# EAGLE design PiZeroAudioI2SPam8403 (EAGLE 9.1.3)
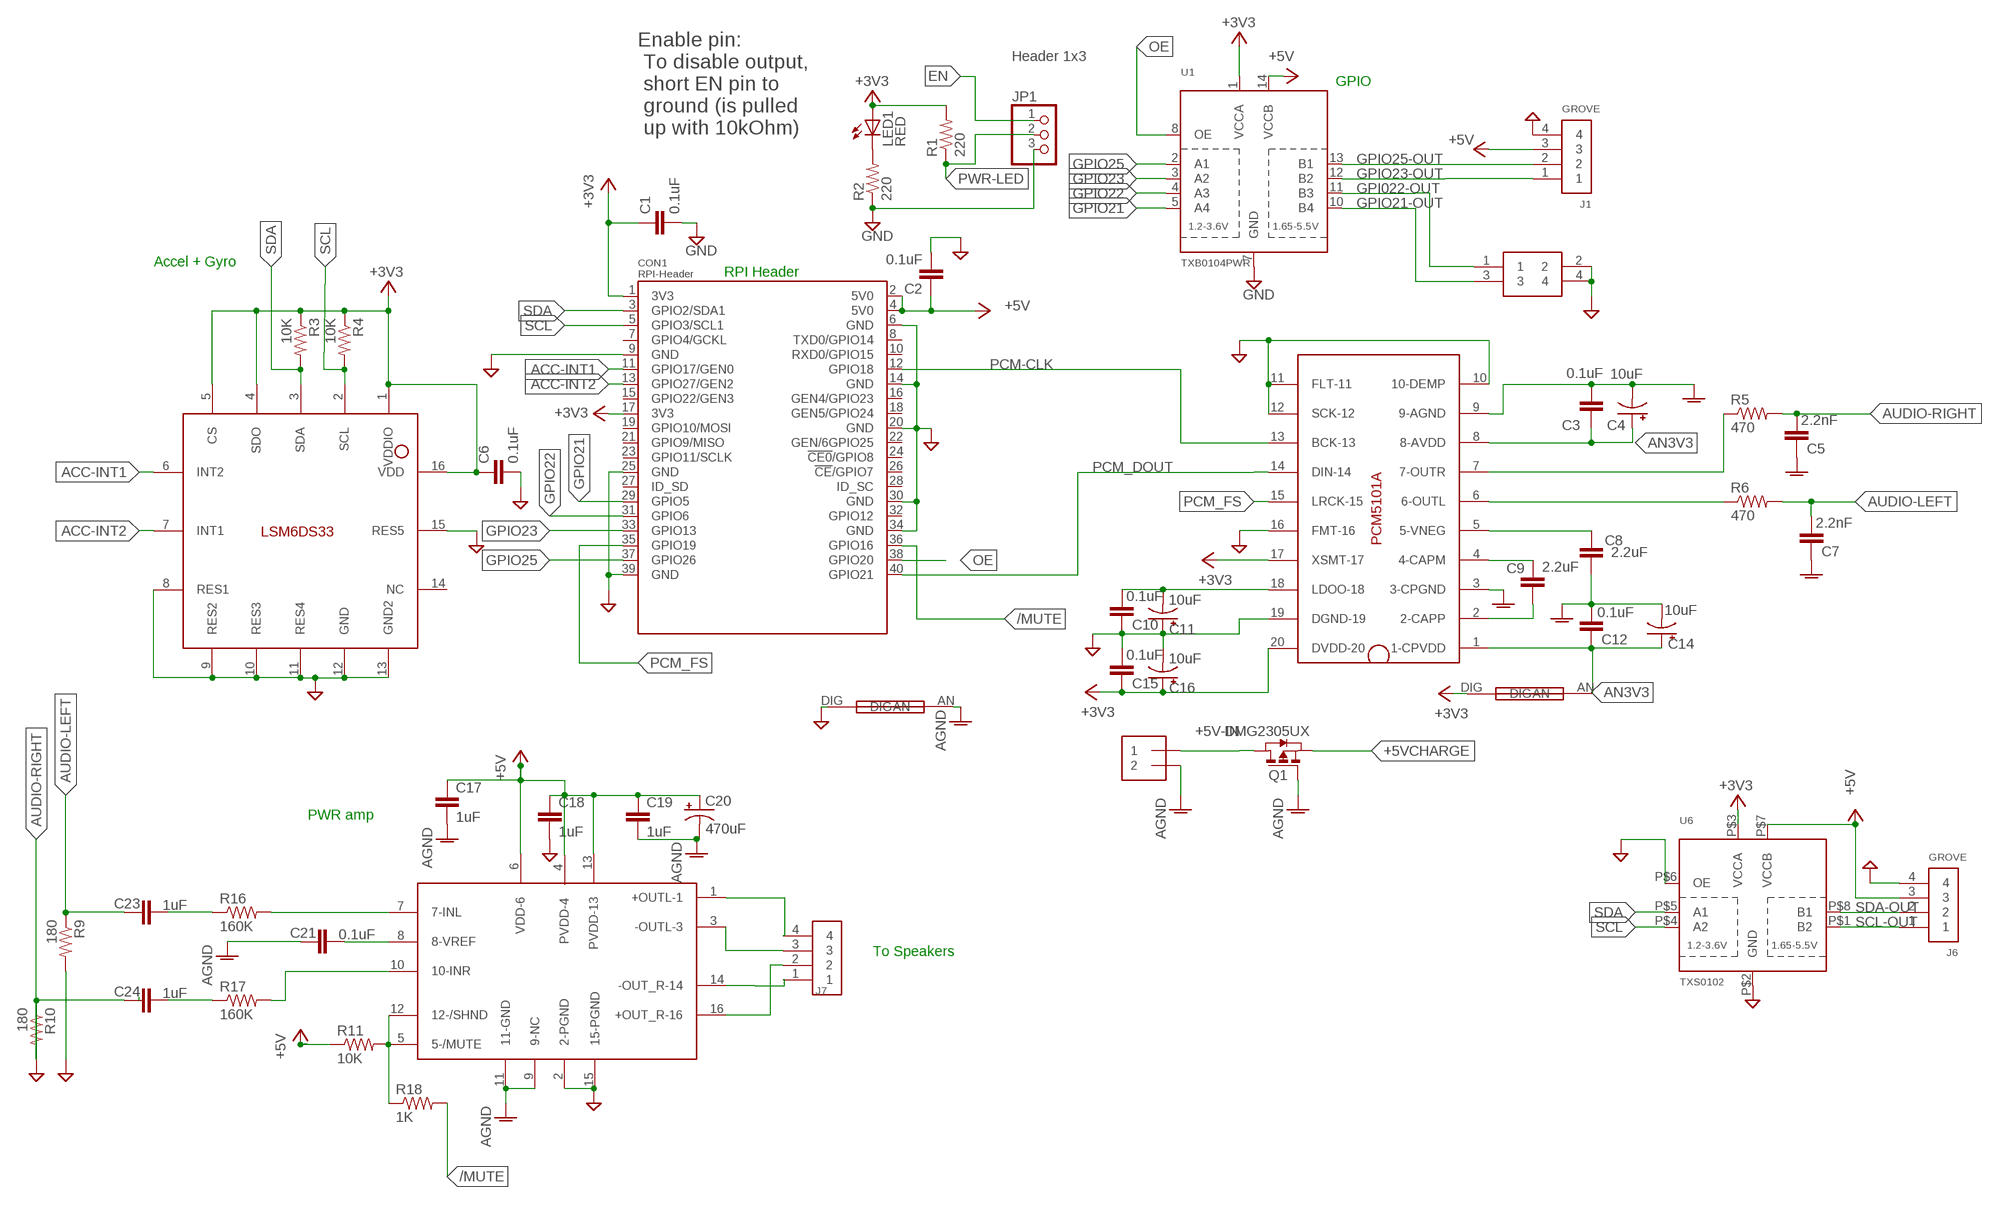
[diagram p0: schematic, sheet 1, part 1 of 2]
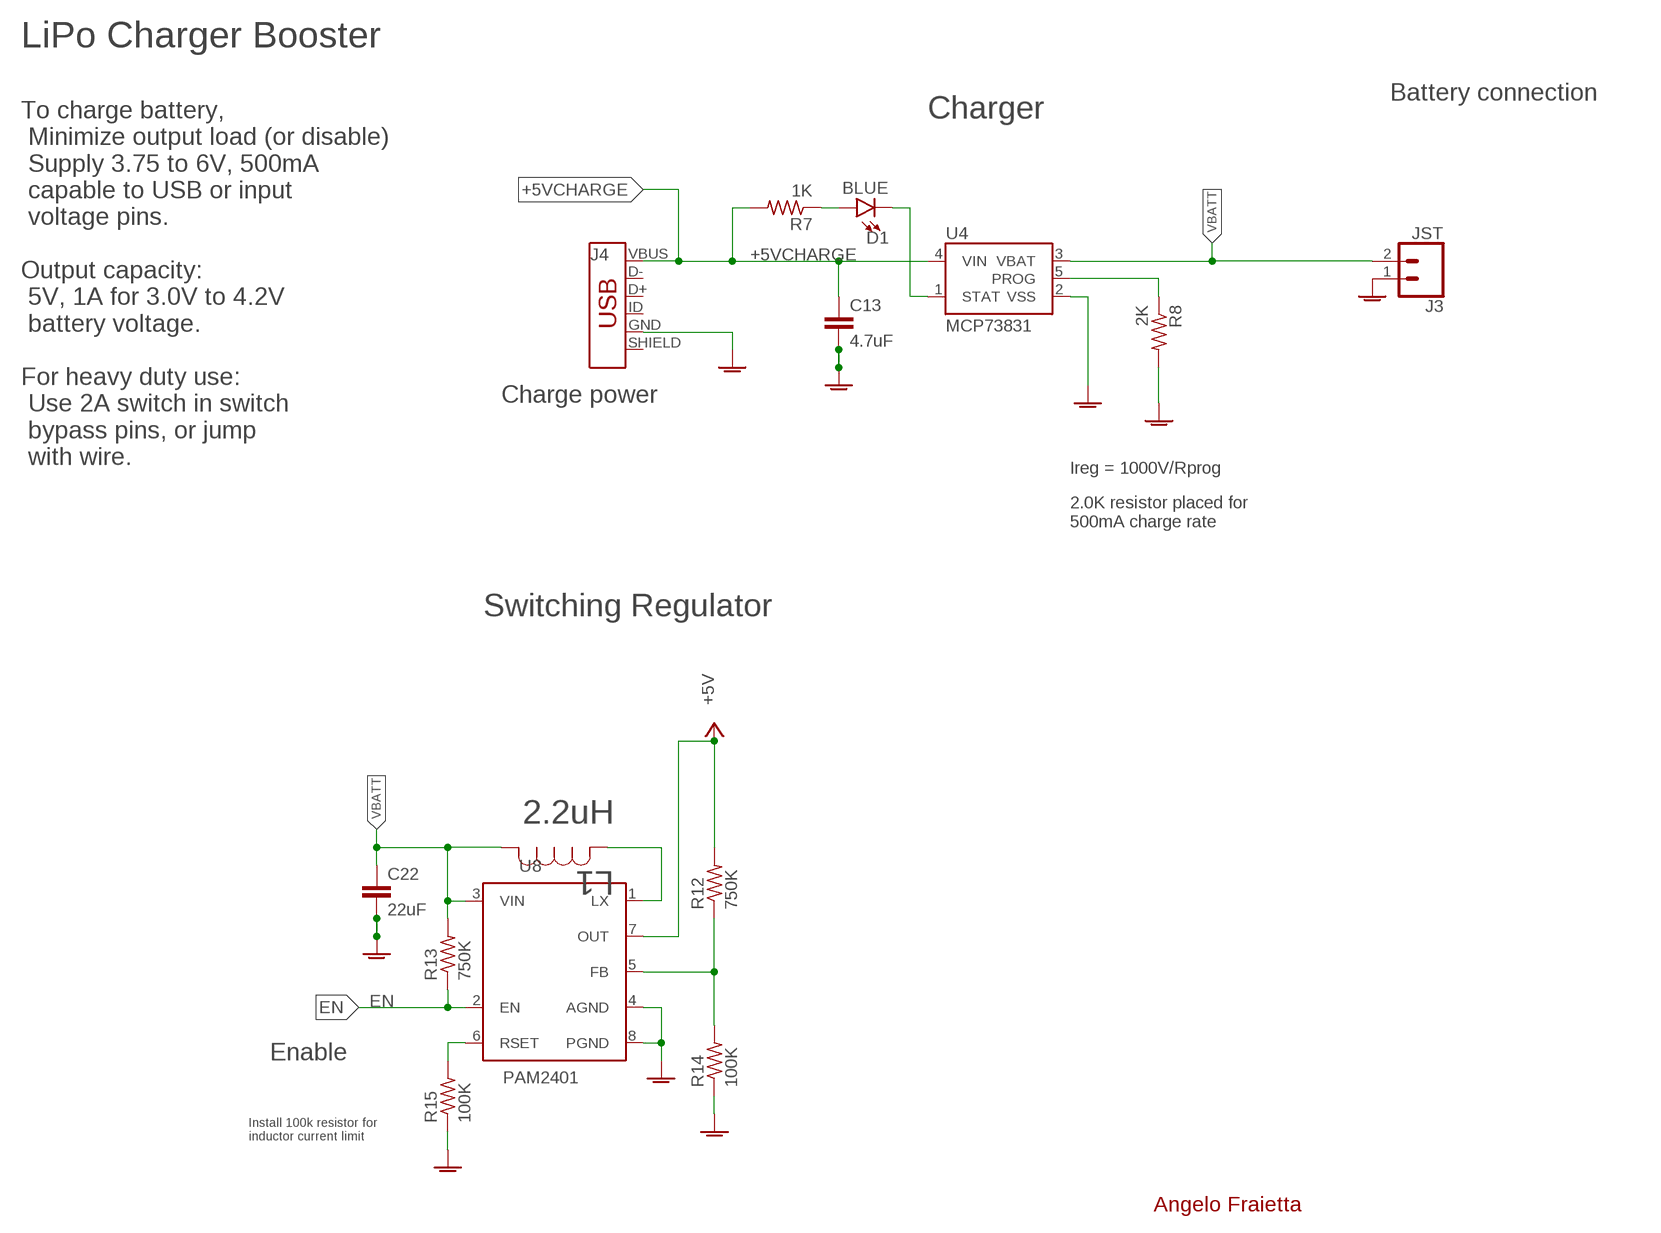
[diagram p1: schematic, sheet 1, part 2 of 2]

## Parts
C1  0.1uF  C-EUC0603  [C0603]
C2  0.1uF  C-EUC0603  [C0603]
C3  0.1uF  C-EUC0603  [C0603]
C4  10uF  CAP-POLARISED1206-POLAR  [EIA3216]
C5  2.2nF  C-EUC0603  [C0603]
C6  0.1uF  C-EUC0603  [C0603]
C7  2.2nF  C-EUC0603  [C0603]
C8  2.2uF  C-EUC0603  [C0603]
C9  2.2uF  C-EUC0603  [C0603]
C10  0.1uF  C-EUC0603  [C0603]
C11  10uF  CAP-POLARISED1206-POLAR  [EIA3216]
C12  0.1uF  C-EUC0603  [C0603]
C13  4.7uF  C-EUC0603  [C0603]
C14  10uF  CAP-POLARISED1206-POLAR  [EIA3216]
C15  0.1uF  C-EUC0603  [C0603]
C16  10uF  CAP-POLARISED1206-POLAR  [EIA3216]
C17  1uF  C-EUC0603  [C0603]
C18  1uF  C-EUC0603  [C0603]
C19  1uF  C-EUC0603  [C0603]
C20  470uF  CAP-POLARISED2917-POLAR  [EIA7343]
C21  0.1uF  C-EUC0603  [C0603]
C22  22uF  C-EUC0603  [C0603]
C23  1uF  C-EUC0603  [C0603]
C24  1uF  C-EUC0603  [C0603]
CON1  RPI-Header  RPI-ZERO  [RASPBERRYPI_BASTELSTUBE_V13_RASPI_BOARD_B+_FULL]
D1  BLUE  LED-BLUE0603  [LED-0603]
J1  GROVE  [JST-PH4]
J2  2X2HEADER  [2X2]
J3  JST  CONN_02-JST-2MM-SMT  [JST-2-SMD]
J4  AMP FCI 10103594-0001LF  AMP10103594-0001LF  [USB-MICROB-PTH]
J5  2X1-LOCKING  [22-23-2021]
J6  GROVE  [JST-PH4]
J7  4X1-LOCKING  [22-23-2041]
JP1  Header 1x3  PINHD-1X3  [1X03]
L1  2.2uH  IFSC1515AHER2R2M01  [IND_IFSC_1515AH]
LED1  RED  LEDCHIP-LED0805  [CHIP-LED0805]
Q1  DMG2305UX  [SOT23]
R1  220  R-US_R0603  [R0603]
R2  220  R-US_R0603  [R0603]
R3  10K  R-US_R0603  [R0603]
R4  10K  R-US_R0603  [R0603]
R5  470  R-US_R0603  [R0603]
R6  470  R-US_R0603  [R0603]
R7  1K  R-US_R0603  [R0603]
R8  2K  R-US_R0603  [R0603]
R9  180  R-US_R0603  [R0603]
R10  180  R-US_R0603  [R0603]
R11  10K  R-US_R0603  [R0603]
R12  750K  R-US_R0603  [R0603]
R13  750K  R-US_R0603  [R0603]
R14  100K  R-US_R0603  [R0603]
R15  100K  R-US_R0603  [R0603]
R16  160K  R-US_R0603  [R0603]
R17  160K  R-US_R0603  [R0603]
R18  1K  R-US_R0603  [R0603]
SH1  SHORT  [SHORT]
SH2  SHORT  [SHORT]
U1  TXB0104PWR  [TSSOP14]
U2  LSM6DS33  LSM6DS33LGA-16-3X3  [LGA-16-3X3]
U3  PCM5101A  [TSSOP20-0.65-6.5X4.4MM]
U4  MCP73831  [SOT23-5]
U6  TXS0102  [VFSOP-8]
U7  PAM8403  [SOP-16]
U8  PAM2401  [MSOP8]

## Nets
+3V3: C1.1 C6.1 C15.2 C16.+ CON1.1(3V3) CON1.17(3V3) LED1.A R1.2 R3.1 R4.1 SH1.DIG U1.1(VCCA) U2.1(VDDIO) U2.4(SDO) U2.5(CS) U2.16(VDD) U3.17(XSMT-17) U3.20(DVDD-20) U6.P$3(VCCA)
+5V: C2.1 C17.1 C18.1 C19.1 C20.+ CON1.2(5V0) CON1.4(5V0) J1.3 J6.3 R11.1 R12.2 U1.14(VCCB) U6.P$7(VCCB) U7.4(PVDD-4) U7.6(VDD-6) U7.13(PVDD-13) U8.7(OUT)
+5V-IN: J5.1 Q1.D
+5VCHARGE: C13.1 J4.VBUS Q1.S R7.2 U4.4(VIN)
/MUTE: CON1.36(GPIO16) R11.2 R18.1 R18.2 U7.5(5-/MUTE) U7.12(12-/SHND)
ACC-INT1: CON1.11(GPIO17/GEN0) U2.6(INT2)
ACC-INT2: CON1.13(GPIO27/GEN2) U2.7(INT1)
AGND: C3.1 C4.- C5.2 C7.2 C8.2 C12.1 C13.2 C14.- C17.2 C19.2 C20.- C21.2 C22.2 J3.1 J4.GND J5.2 Q1.G R8.2 R14.1 R15.1 SH2.AN U3.3(3-CPGND) U3.9(9-AGND) U4.2(VSS) U7.9(9-NC) U7.11(11-GND) U8.4(AGND) U8.8(PGND)
AN3V3: C3.2 C4.+ C12.2 C14.+ SH1.AN U3.1(1-CPVDD) U3.8(8-AVDD)
AUDIO-LEFT: C7.1 C23.2 R6.2 R9.1
AUDIO-RIGHT: C5.1 R5.2 R10.1
EN: JP1.1 R13.1 U8.2(EN)
GND: C1.2 C2.2 C6.2 C10.2 C11.+ C15.1 C16.- C18.2 C24.2 CON1.6(GND) CON1.9(GND) CON1.14(GND) CON1.20(GND) CON1.25(GND) CON1.30(GND) CON1.34(GND) CON1.39(GND) J1.4 J2.2 J2.4 J6.4 JP1.3 R2.1 R9.2 R10.2 SH2.DIG U1.7(GND) U2.8(RES1) U2.9(RES2) U2.10(RES3) U2.11(RES4) U2.12(GND) U2.13(GND2) U2.15(RES5) U3.10(10-DEMP) U3.11(FLT-11) U3.12(SCK-12) U3.16(FMT-16) U3.19(DGND-19) U6.P$2(GND) U6.P$6(OE) U7.2(2-PGND) U7.15(15-PGND)
GPI022-OUT: J2.1 U1.11(B3)
GPIO21: CON1.29(GPIO5) U1.5(A4)
GPIO21-OUT: J2.3 U1.10(B4)
GPIO22: CON1.31(GPIO6) U1.4(A3)
GPIO23: CON1.33(GPIO13) U1.3(A2)
GPIO23-OUT: J1.1 U1.12(B2)
GPIO25: CON1.37(GPIO26) U1.2(A1)
GPIO25-OUT: J1.2 U1.13(B1)
L+: J7.4 U7.1(+OUTL-1)
L-: J7.3 U7.3(-OUTL-3)
N$1: R5.1 U3.7(7-OUTR)
N$2: C8.1 U3.5(5-VNEG)
N$3: C9.1 U3.4(4-CAPM)
N$4: C9.2 U3.2(2-CAPP)
N$5: C24.1 R17.1
N$6: LED1.C R2.2
N$7: C21.1 U7.8(8-VREF)
N$8: R16.2 U7.7(7-INL)
N$10: R17.2 U7.10(10-INR)
N$11: R6.1 U3.6(6-OUTL)
N$12: C10.1 C11.- U3.18(LDOO-18)
N$13: C23.1 R16.1
N$15: R8.1 U4.5(PROG)
N$16: D1.C U4.1(STAT)
N$17: R12.1 R14.2 U8.5(FB)
N$18: L1.2 U8.1(LX)
N$19: R15.2 U8.6(RSET)
N$23: D1.A R7.1
OE: CON1.38(GPIO20) U1.8(OE)
PCM-CLK: CON1.12(GPIO18) U3.13(BCK-13)
PCM_DOUT: CON1.40(GPIO21) U3.14(DIN-14)
PCM_FS: CON1.35(GPIO19) U3.15(LRCK-15)
PWR-LED: JP1.2 R1.1
R+: J7.2 U7.16(+OUT_R-16)
R-: J7.1 U7.14(-OUT_R-14)
SCL: CON1.5(GPIO3/SCL1) R4.2 U2.2(SCL) U6.P$4(A2)
SCL-OUT: J6.1 U6.P$1(B2)
SDA: CON1.3(GPIO2/SDA1) R3.2 U2.3(SDA) U6.P$5(A1)
SDA-OUT: J6.2 U6.P$8(B1)
VBATT: C22.1 J3.2 L1.1 R13.2 U4.3(VBAT) U8.3(VIN)
Unconnected: CON1.7(GPIO4/GCKL) CON1.8(TXD0/GPIO14) CON1.10(RXD0/GPIO15) CON1.15(GPIO22/GEN3) CON1.16(GEN4/GPIO23) CON1.18(GEN5/GPIO24) CON1.19(GPIO10/MOSI) CON1.21(GPIO9/MISO) CON1.22(GEN/6GPIO25) CON1.23(GPIO11/SCLK) CON1.24(!CE0!/GPIO8) CON1.26(!CE!/GPIO7) CON1.27(ID_SD) CON1.28(ID_SC) CON1.32(GPIO12) J4.D+ J4.D- J4.ID J4.SHIELD U2.14(NC)

## Notes on the sheet
- Enable pin:
   To disable output,
   short EN pin to
   ground (is pulled
   up with 10kOhm)
- GPIO
- Accel + Gyro | RPI Header
- LiPo Charger Booster
- To charge battery,
   Minimize output load (or disable)
   Supply 3.75 to 6V, 500mA
   capable to USB or input
   voltage pins.
- Battery connection
- Charger
- Output capacity:
   5V, 1A for 3.0V to 4.2V
   battery voltage.
- For heavy duty use:
   Use 2A switch in switch
   bypass pins, or jump
   with wire.
- Charge power
- Ireg = 1000V/Rprog
- 2.0K resistor placed for
  500mA charge rate
- PWR amp
- Switching Regulator
- To Speakers
- Enable
- Install 100k resistor for
  inductor current limit
- Angelo Fraietta

## Library data of the parts
C1-C3 C6 C10 C12 C15 C21 C23 C24 = rcl:C-EU: CAPACITOR, European symbol; MF: MULTICOMP; MPN: MC0603F104Z500CT; OC_FARNELL: 1759123; SPICEPREFIX: C
C4 C11 C14 C16 = HappyBrackets:CAP-POLARISED: Polarised capacitor; MF: AVX; MPN: F931C106MAA; OC_FARNELL: 2852673
C5 C7 C13 C17-C19 = rcl:C-EU: CAPACITOR, European symbol; OC_FARNELL: unknown; SPICEPREFIX: C
C8 C9 = rcl:C-EU: CAPACITOR, European symbol; MF: TAIYO YUDEN; MPN: TMK107ABJ225KA-T; OC_FARNELL: 2503459; SPICEPREFIX: C
C20 = HappyBrackets:CAP-POLARISED: Polarised capacitor; MF: VISHAY; MPN: 293D477X9010E2TE3; OC_FARNELL: 2353079
C22 = resistor:C-EU: CAPACITOR, European symbol; MF: MURATA; MPN: GRM188R61A226ME15D; OC_FARNELL: 2426957
CON1 = RPI-Zero:RPI-ZERO: Adafruit GPIO Header for Raspberry Pi HAT - 2x20 Short Female Header; OC_FARNELL: unknown
D1 = SparkFun-LED:LED-BLUE: Blue SMD LED Used in manufacturing of various products at SparkFun Packages: 0603 - SMD 0603 package [Product Link] <http://www.digikey.com/product-detail/en/SMLE12BC7TT86/511-1589-2-ND/1641808> 1206 - SMD1206 package [Product Link] <http://www.digikey.com/product-detail/en/lite-on-inc/LTST-C150TBKT/160-1643-1-ND/573584> SparkFun Products: ESP8266 Thing-Dev Board <https://www.sparkfun.com/products/13711> RedBoard <https://www.sparkfun.com/products/12757>; OC_FARNELL: unknown; PROD_ID: DIO-08575
J1 J6 = HappyBrackets:GROVE; DIGIKEY: 1597-1082-ND; OC_FARNELL: unknown
J2 = HappyBrackets:2X2HEADER: 2x2 2.54mm header; OC_FARNELL: unknown
J3 = SparkFun-Connectors:CONN_02: Multi connection point. Often used as Generic Header-pin footprint for 0.1 inch spaced/style header connections On any of the 0.1 inch spaced packages, you can populate with these: Break Away Headers - Straight <https://www.sparkfun.com/products/116> (PRT-00116) Break Away Male Headers - Right Angle <https://www.sparkfun.com/products/553> (PRT-00553) Female Headers <https://www.sparkfun.com/products/115> (PRT-00115) Break Away Headers - Machine Pin <https://www.sparkfun.com/products/117> (PRT-00117) Break Away Female Headers - Swiss Machine Pin <https://www.sparkfun.com/products/743> (PRT-00743) For SCREWTERMINALS and SPRING TERMINALS visit here: Screw Terimnals on SparkFun.com <https://www.sparkfun.com/search/results?term=Screw+Terminals> (5mm/3.5mm/2.54mm spacing) This device is also useful as a general connection point to wire up your design to another part of your project. Our various solder wires solder well into these plated through hole pads. Hook-Up Wire - Assortment (Stranded, 22 AWG) <https://www.sparkfun.com/products/11375> (PRT-11375) Hook-Up Wire - Assortment (Solid Core, 22 AWG) <https://www.sparkfun.com/products/11367> (PRT-11367) View the entire wire category on our website here <https://www.sparkfun.com/categories/141> Special notes: Molex polarized connector foot print use with: PRT-08233 with associated crimp pins and housings. 2.54_SCREWTERM for use with PRT-10571. 3.5mm Screw Terminal footprints for PRT-08084 5mm Screw Terminal footprints for use with PRT-08432; MF: JST (JAPAN SOLDERLESS TERMINALS); MPN: S2B-PH-SM4-TB(LF)(SN); OC_FARNELL: 9492615; PROD_ID: CONN-11443
J4 = HappyBrackets:AMP10103594-0001LF: USB - micro B USB 2.0 Receptacle Connector 5 Position Surface Mount, Right Angle; Through Hole Digikey 609-4050-1-ND; DIGIKEY: 609-4050-1-ND; MF: AMPHENOL ICC (FCI); MPN: 10103594-0001LF; OC_FARNELL: 2293752
J5 = HappyBrackets:2X1-LOCKING: 2x1 Locking Header https://www.molex.com/pdm_docs/sd/022272021_sd.pdf; DIGIKEY: WM4200-ND; OC_FARNELL: unknown
J7 = HappyBrackets:4X1-LOCKING: CONN HEADER 4POS .100 VERT TIN; DIGIKEY: WM4202-ND; OC_FARNELL: unknown
JP1 = adafruit:PINHD-1X3: PIN HEADER; OC_FARNELL: unknown
L1 = HappyBrackets:IFSC1515AHER2R2M01: Inductor 2.2UH 3A 45 MOHM SMD; DIGIKEY: 541-1404-1-ND; MF: VISHAY; MPN: IFSC1515AHER2R2M01; OC_FARNELL: 2352690; VENDOR: VISHAY
LED1 = adafruit:LED: LED OSRAM: - CHIPLED LG R971, LG N971, LY N971, LG Q971, LY Q971, LO R971, LY R971 LH N974, LH R974 LS Q976, LO Q976, LY Q976 LO Q996 - Hyper CHIPLED LW Q18S LB Q993, LB Q99A, LB R99A - SideLED LS A670, LO A670, LY A670, LG A670, LP A670 LB A673, LV A673, LT A673, LW A673 LH A674 LY A675 LS A676, LA A676, LO A676, LY A676, LW A676 LS A679, LY A679, LG A679 - Hyper Micro SIDELED® LS Y876, LA Y876, LO Y876, LY Y876 LT Y87S - SmartLED LW L88C, LW L88S LB L89C, LB L89S, LG L890 LS L89K, LO L89K, LY L89K LS L896, LA L896, LO L896, LY L896 - TOPLED LS T670, LO T670, LY T670, LG T670, LP T670 LSG T670, LSP T670, LSY T670, LOP T670, LYG T670 LG T671, LOG T671, LSG T671 LB T673, LV T673, LT T673, LW T673 LH T674 LS T676, LA T676, LO T676, LY T676, LB T676, LH T676, LSB T676, LW T676 LB T67C, LV T67C, LT T67C, LS T67K, LO T67K, LY T67K, LW E67C LS E67B, LA E67B, LO E67B, LY E67B, LB E67C, LV E67C, LT E67C LW T67C LS T679, LY T679, LG T679 LS T770, LO T770, LY T770, LG T770, LP T770 LB T773, LV T773, LT T773, LW T773 LH T774 LS E675, LA E675, LY E675, LS T675 LS T776, LA T776, LO T776, LY T776, LB T776 LHGB T686 LT T68C, LB T68C - Hyper Mini TOPLED® LB M676 - Mini TOPLED Santana® LG M470 LS M47K, LO M47K, LY M47K Source: http://www.osram.convergy.de/; OC_FARNELL: unknown
Q1 = HappyBrackets:DMG2305UX: P-CHANNEL ENHANCEMENT MODE MOSFET This MOSFET is designed to minimize the on-state resistance (RDS(ON)), yet maintain superior switching performance, making it ideal for high efficiency power management applications.; DIGIKEY: DMG2305UX-7DICT-ND; MF: DIODES INC.; MPN: DMG2305UX-7; OC_FARNELL: 2543533
R1 R2 = adafruit:R-US_: RESISTOR, American symbol; MF: YAGEO; MPN: RC0603FR-07220RL; OC_FARNELL: 2421863
R3 R4 R11 R18 = adafruit:R-US_: RESISTOR, American symbol; MF: YAGEO; MPN: RC0603FR-0710KL; OC_FARNELL: 2133286
R5 R6 R9 R10 R16 R17 = adafruit:R-US_: RESISTOR, American symbol; MF: PANASONIC ELECTRONIC COMPONENTS; MPN: ERJ3EKF4700V; OC_FARNELL: 2303120
R7 = adafruit:R-US_: RESISTOR, American symbol; MF: VISHAY; MPN: CRCW06031K00FKEA; OC_FARNELL: 1469740
R8 = adafruit:R-US_: RESISTOR, American symbol; OC_FARNELL: unknown
R12 R13 = adafruit:R-US_: RESISTOR, American symbol; MF: VISHAY; MPN: CRCW0603750KFKEA; OC_FARNELL: 1152123
R14 R15 = adafruit:R-US_: RESISTOR, American symbol; MF: PANASONIC ELECTRONIC COMPONENTS; MPN: ERJ-3EKF1003V; OC_FARNELL: 2289601
SH1 SH2 = HappyBrackets:SHORT: Creates a short so analogue and digital power can have different net names. You will need to approve DRC error checks to use this; OC_FARNELL: unknown
U1 = adafruit:TXB0104PWR: 4-Bit Bi-Directional Level Shifter 1.2V-3.6V (VCCA) to 1.65V-5.5V (VCCB) bi-directional level shifter with auto direction sensing. Max data rate - VCCA 1.8V: 20Mbps (50ns), VCCA 3.3V: 100Mbps (10ns) Digikey: 296-21929-1-ND; MF: TEXAS INSTRUMENTS; MPN: TXB0104PWR; OC_FARNELL: 1607891
U2 = HappyBrackets:LSM6DS33: iNEMO inertial module: always-on 3D accelerometer and 3D gyroscope; DIGIKEY: 497-15996-1-ND; MF: STMICROELECTRONICS; MPN: LSM6DS33TR; OC_FARNELL: 2762756
U3 = HappyBrackets:PCM5101A: PCM510xA 2.1VRMS, 112/106/100dB AudioStereoDAC with PLL and 32-bit, 384 kHz PCM Interface; DIGIKEY: 296-36706-1-ND; MF: TEXAS INSTRUMENTS; MPN: PCM5101AQPWRQ1; OC_FARNELL: 2402250
U4 = SparkFun-IC-Power:MCP73831: MCP73831T Li-Ion, Li-Pol Controller Miniature single cell, fully integrated Li-Ion, Li-polymer charge management controller Datasheet <http://ww1.microchip.com/downloads/en/DeviceDoc/20001984g.pdf> SparkFun Products: SparkFun ESP32 Thing <https://www.sparkfun.com/products/13907> SparkFun 9DoF Razor IMU M0 <https://www.sparkfun.com/products/14001>; MF: MICROCHIP; MPN: MCP73831T-2ACI/OT; OC_FARNELL: 1332158; PROD_ID: IC-09995
U6 = adafruit:TXS0102: 2-Bit Bi-Directional Level Shifter (I2C, etc.) Designed for I2C devices and has internal pullups. Not to be confused with TXB010x series. 1.2V-3.6V (VCCA) to 1.65V-5.5V (VCCB) bi-directional level shifter with auto direction sensing. Max data rate - 24Mbps (Push Pull), 2Mbps (Open Drain) Digikey: 296-21931-1-ND; OC_FARNELL: unknown
U7 = HappyBrackets:PAM8403: PAM8403 The PAM8403 is a 3W, class-D audio amplifier. It offers low THD+N, allowing it to achieve high-quality sound reproduction. The new filterless architecture allows the device to drive the speaker directly, requiring no low-pass output filters, thus saving system cost and PCB area. With the same numbers of external components, the efficiency of the PAM8403 is much better than that of Class-AB cousins. It can extend the battery life, which makes it well-suited for portable applications. The PAM8403 is available in SOP-16 package.; DIGIKEY: PAM8403DRDICT-ND; OC_FARNELL: unknown
U8 = SparkFun-IC-Power:PAM2401: PAM2401 - Boost PMIC Specifications: Up to 1A output current 0.9V to 4.75V Input Range 2.5V to 5.0V Adjustable Output Voltage Datasheet <https://www.diodes.com/assets/Datasheets/PAM2401.pdf> (Diodes inc.); OC_FARNELL: unknown; PROD_ID: IC-13769

## Net classes
0 default: width 0.152 mm, clearance 0.152 mm
2 PWM-LEFT: width 0.305 mm, drill 0.508 mm, clearance 0.508 mm
3 PWM-RIGHT: width 0.305 mm, drill 0.508 mm, clearance 0.508 mm
4 AUDIO-L: width 0.305 mm, drill 0.508 mm, clearance 0.508 mm
5 AUDIO-R: width 0.305 mm, drill 0.508 mm, clearance 0.508 mm
6 +5V: width 0.508 mm, drill 0.508 mm, clearance 0.254 mm

## Board
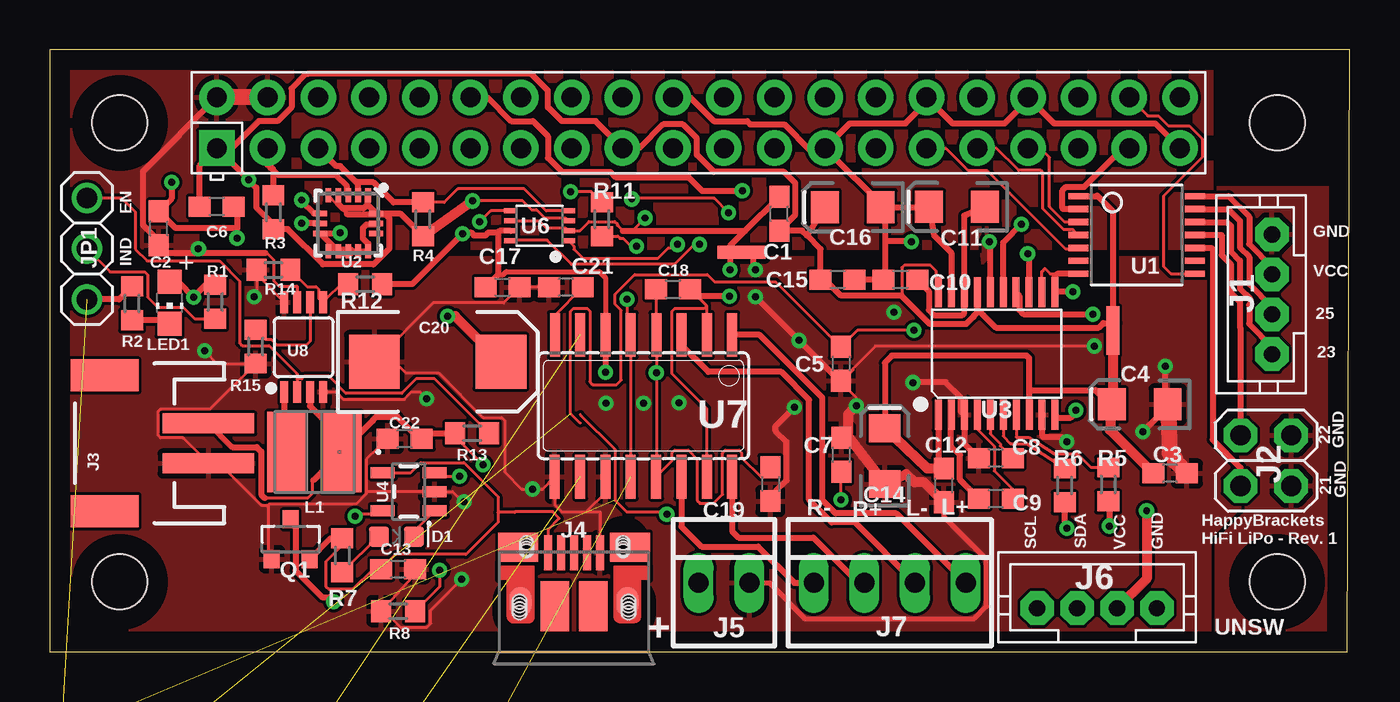
[diagram p2: board, top side]
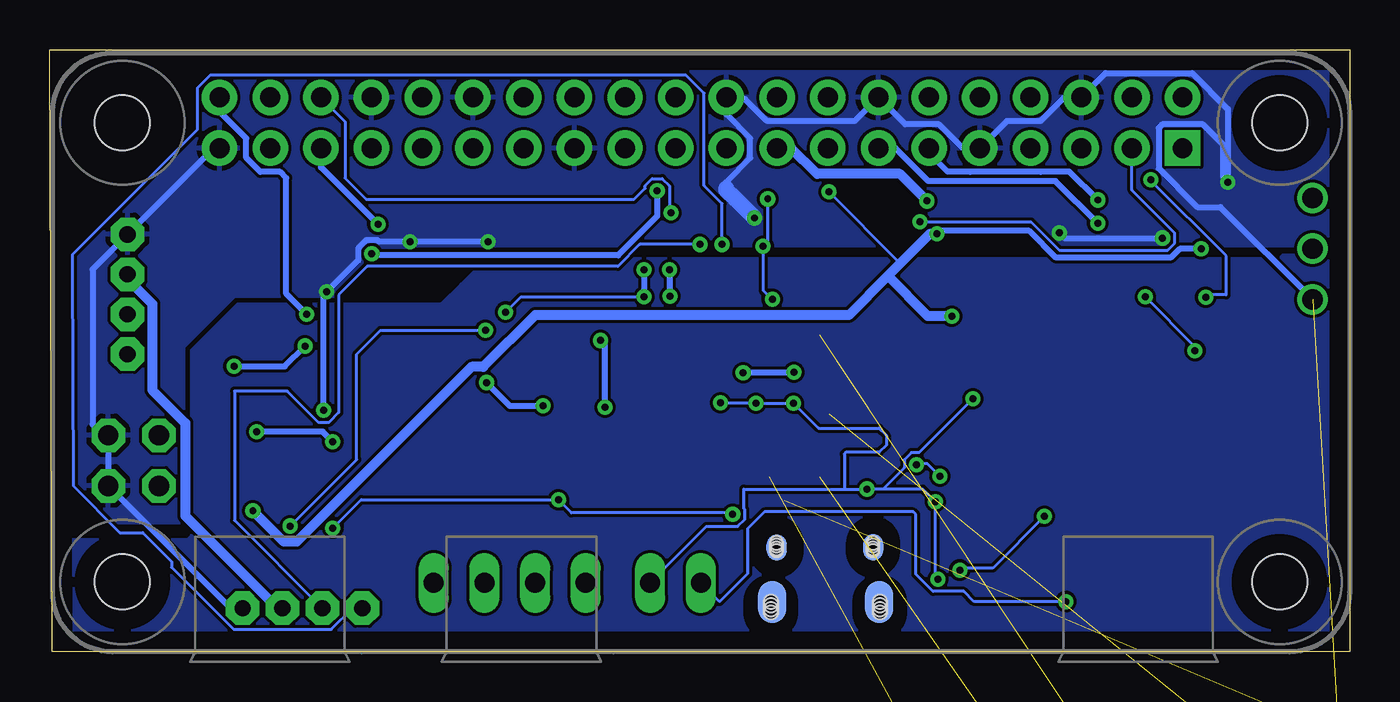
[diagram p3: board, bottom side, seen from below]

Size 65.13 x 30.15 mm. Coordinates in mm from the lower left corner, seen from the top.
Outline: 0,0 65.02,0 65.13,30.15 0,30.15 0,0
Copper layers (1*16): Top 0.035mm / dielectric 1.5mm / Bottom 0.035mm
Design rules "default": minimum track width 6mil, minimum drill 0.35mm, track to track 6mil, track to pad 6mil, pad to pad 6mil, via to via 6mil, smd to smd 6mil, copper to edge 40mil, drill to drill 6mil, minimum pad ring 10mil, minimum via ring 8mil, stop-mask expansion 4mil, vias tented up to drill 0mil, thermal gap 10mil

### Footprints (pad centres in the part's own frame; a part is rotated, then mirrored left to right if it is on the bottom)
C0603 = smd 1.1 x 1: 1 -0.85,0; 2 0.85,0
EIA3216 = smd 1.4 x 1.6: + 1.4,0; - -1.4,0
EIA7343 = smd 2.55 x 2.7: + 3.17,0; - -3.17,0
RASPBERRYPI_BASTELSTUBE_V13_RASPI_BOARD_B+_FULL = drill 1 pad 1.778 square: 1 8.37,25.23 | drill 1 pad 1.778: 2 8.37,27.77; 3 10.91,25.23; 4 10.91,27.77; 5 13.45,25.23; 6 13.45,27.77; 7 15.99,25.23; 8 15.99,27.77; 9 18.53,25.23; 10 18.53,27.77; 11 21.07,25.23; 12 21.07,27.77; 13 23.61,25.23; 14 23.61,27.77; 15 26.15,25.23; 16 26.15,27.77; 17 28.69,25.23; 18 28.69,27.77; 19 31.23,25.23; 20 31.23,27.77; 21 33.77,25.23; 22 33.77,27.77; 23 36.31,25.23; 24 36.31,27.77; 25 38.85,25.23; 26 38.85,27.77; 27 41.39,25.23; 28 41.39,27.77; 29 43.93,25.23; 30 43.93,27.77; 31 46.47,25.23; 32 46.47,27.77; 33 49.01,25.23; 34 49.01,27.77; 35 51.55,25.23; 36 51.55,27.77; 37 54.09,25.23; 38 54.09,27.77; 39 56.63,25.23; 40 56.63,27.77 | hole 2.75: 3.5,3.5; 3.5,26.5; 61.5,3.5; 61.5,26.5
LED-0603 = smd 1 x 1: A -0.877,0; C 0.877,0
JST-PH4 = drill 0.813 pad 1.676 octagon: 1 -3,0; 2 -1,0; 3 1,0; 4 3,0
2X2 = drill 1.016 pad 1.676 octagon: 1 -3.81,-1.27; 2 -3.81,1.27; 3 -1.27,-1.27; 4 -1.27,1.27
JST-2-SMD = smd 1 x 4.6: 1 -1,-3.7; 2 1,-3.7 | smd 1.6 x 3.4: NC1 -3.4,1.5; NC2 3.4,1.5
USB-MICROB-PTH = smd 1.4 x 2.1 bottom: 7 2.676,-2.488; SHIELD5 -2.684,-2.49 | smd 0.4 x 1.75: D+ 0.006,-0.015; D- -0.644,-0.015; GND 1.306,-0.015; ID 0.656,-0.015; VBUS -1.294,-0.015 | smd 2 x 1.46: SHEILD2 2.806,0.26; SHIELD -2.806,0.26 | smd 1.425 x 2.5: SHIELD3 -0.966,-2.695; SHIELD4 0.971,-2.698 | smd 1.1 x 1.5: SHIELD6 2.676,-2.488; SHIELD8 -2.684,-2.49 | smd 1 x 1.3 bottom: SHIELD9 -2.393,0.258; SHIELD12 2.456,0.252 | smd 1 x 1.3: SHIELD10 -2.393,0.258; SHIELD11 2.462,0.248 | hole 0.7: -2.718,-2.48; -2.718,-2.646; -2.719,-2.845; -2.719,-3.01; 2.743,-2.48; 2.742,-2.649; 2.741,-2.842; 2.741,-3.01 | hole 0.66: -2.385,0.475; -2.375,0.345; -2.385,0.195; -2.379,0.086; 2.455,0.475; 2.465,0.345; 2.455,0.195; 2.461,0.086
22-23-2021 = drill 1 long: 1 -1.27,0; 2 1.27,0
22-23-2041 = drill 1 long: 1 -3.81,0; 2 -1.27,0; 3 1.27,0; 4 3.81,0
1X03 = drill 1.016: 1 -2.54,0; 2 0,0; 3 2.54,0
IND_IFSC_1515AH = smd 2.007 x 4.013: 1 -1.359,0; 2 1.359,0
CHIP-LED0805 = smd 1.2 x 1.2: A 0,-1.05; C 0,1.05
SOT23 = smd 0.8 x 0.9: D 0,1; G -0.95,-1; S 0.95,-1
R0603 = smd 1 x 1.1: 1 -0.85,0; 2 0.85,0
SHORT = smd 1.27 x 0.635: AN -0.635,0; DIG 0.508,0
TSSOP14 = smd 0.305 x 0.991: 1 -1.95,-2.918; 2 -1.3,-2.918; 3 -0.65,-2.918; 4 0,-2.918; 5 0.65,-2.918; 6 1.3,-2.918; 7 1.95,-2.918; 8 1.95,2.918; 9 1.3,2.918; 10 0.65,2.918; 11 0,2.918; 12 -0.65,2.918; 13 -1.3,2.918; 14 -1.95,2.918
LGA-16-3X3 = smd 0.7 x 0.28: 1 -1.4,1; 2 -1.4,0.5; 3 -1.4,0; 4 -1.4,-0.5; 5 -1.4,-1; 9 1.4,-1; 10 1.4,-0.5; 11 1.4,0; 12 1.4,0.5; 13 1.4,1 | smd 0.28 x 0.7: 6 -0.5,-1.4; 7 0,-1.4; 8 0.5,-1.4; 14 0.5,1.4; 15 0,1.4; 16 -0.5,1.4
TSSOP20-0.65-6.5X4.4MM = smd 0.35 x 1.5: 1 -2.925,-3.065; 2 -2.275,-3.065; 3 -1.625,-3.065; 4 -0.975,-3.065; 5 -0.325,-3.065; 6 0.325,-3.065; 7 0.975,-3.065; 8 1.625,-3.065; 9 2.275,-3.065; 10 2.925,-3.065; 11 2.91,3.065; 12 2.26,3.065; 13 1.61,3.065; 14 0.96,3.065; 15 0.325,3.065; 16 -0.325,3.065; 17 -0.975,3.065; 18 -1.625,3.065; 19 -2.275,3.065; 20 -2.925,3.065
SOT23-5 = smd 0.55 x 1.2: 1 -0.95,-1.3; 2 0,-1.3; 3 0.95,-1.3; 4 0.95,1.3; 5 -0.95,1.3
VFSOP-8 = smd 0.25 x 0.65: P$1 -0.75,-1.45; P$2 -0.25,-1.45; P$3 0.25,-1.45; P$4 0.75,-1.45; P$5 0.75,1.45; P$6 0.25,1.45; P$7 -0.25,1.45; P$8 -0.75,1.45
SOP-16 = smd 0.5 x 2.2: 1 -4.445,-3.55; 2 -3.185,-3.55; 3 -1.915,-3.55; 4 -0.645,-3.55; 5 0.635,-3.55; 6 1.895,-3.55; 7 3.165,-3.55; 8 4.435,-3.55; 9 4.445,3.55; 10 3.175,3.55; 11 1.905,3.55; 12 0.635,3.55; 13 -0.635,3.55; 14 -1.905,3.55; 15 -3.175,3.55; 16 -4.445,3.55
MSOP8 = smd 0.4 x 1.1: 1 -0.975,-2.25; 2 -0.325,-2.25; 3 0.325,-2.25; 4 0.975,-2.25; 5 0.975,2.25; 6 0.325,2.25; 7 -0.325,2.25; 8 -0.975,2.25

### Placement (x,y rotation side)
C1  36.55,21.95 90 top
C2  5.46,21.21 90 top
C3  56.13,8.94 180 top
C4  54.61,12.4 180 top
C5  39.64,14.43 270 top
C6  8.36,22.3 0 top
C7  39.66,9.87 90 top
C8  47.4,9.7 180 top
C9  47.4,7.67 180 top
C10  42.62,18.64 180 top
C11  45.46,22.29 180 top
C12  44.81,8.33 90 top
C13  17.45,4.14 0 top
C14  41.83,9.8 90 top
C15  39.47,18.64 180 top
C16  40.23,22.28 180 top
C17  22.68,18.26 0 top
C18  31.23,18.16 0 top
C19  36.11,8.4 270 top
C20  19.43,14.53 0 top
C21  25.85,18.26 180 top
C22  17.78,10.67 180 top
C23  -0.3,-33.66 0 top  (outside the outline)
C24  -0.3,-38.53 0 top  (outside the outline)
CON1  0,0 0 top
D1  17.37,5.77 0 top
J1  61.24,17.91 90 top
J2  60.93,7.04 270 top
J3  4.25,10.44 90 top
J4  26.26,4.98 0 top
J5  33.78,3.45 0 top
J6  52.48,2.18 0 top
J7  42.09,3.45 0 top
JP1  1.85,20.19 270 top
L1  13.26,10.01 180 top
LED1  5.99,17.48 180 top
Q1  12.06,5.64 0 top
R1  8.28,17.53 90 top
R2  4.11,17.45 270 top
R3  11.2,22.02 90 top
R4  18.69,21.67 90 top
R5  53.04,8.38 270 top
R6  50.85,8.33 270 top
R7  14.66,4.83 90 top
R8  17.45,2.03 180 top
R9  -0.33,-4.85 0 top  (outside the outline)
R10  -0.33,-10.11 0 top  (outside the outline)
R11  27.66,21.67 270 top
R12  15.8,18.41 0 top
R13  21.16,10.95 180 top
R14  11.2,19.13 0 top
R15  10.31,15.29 90 top
R16  -0.33,-23.39 0 top  (outside the outline)
R17  -0.33,-28.65 0 top  (outside the outline)
R18  -0.33,-43.66 0 top  (outside the outline)
SH1  53.26,16.15 90 top
SH2  34.59,20.02 180 top
U1  54.46,20.88 270 top
U2  14.95,21.46 270 top
U3  47.45,14.94 0 top
U4  17.98,8.03 90 top
U6  24.54,21.34 90 top
U7  29.74,12.32 180 top
U8  12.71,15.26 0 top

### Tracks (layer width: path | path; a pad name or v marks a point on that pad's centre or on a via)
+3V
  pour Top: 12.34,30.33 12.34,20.42 12.37,20.4 57.96,20.4 58.06,20.29 58.06,29.72 58.09,29.74 14.76,29.74 14.05,30.45 12.47,30.45
+3V3  (via drill 0.35)
  Top 0.152: U2.5 14.36,22.45 14.43,22.45 | U2.4 14.45,22.36 14.89,21.92 | v21.18,22.58 23.69,22.58 24.13,22.15 24.38,22.15 24.8,21.73 25.84,21.73 U6.P$3 | U3.20 44.42,18.1 44.42,19.07 44.12,19.37 42.83,19.37 42.69,19.24 42.69,17.85 42.68,17.84
  Top 0.305: 14.43,22.45 14.68,22.21 15.71,22.21 15.9,22.4 15.9,22.82 U2.1 15.95,22.36 U2.16 17.55,21.96 R4.1 | C6.1 7.51,24.37 CON1.1 8.51,25.09 | 8.51,25.09 v9.96,23.64 10.35,23.25 10.35,22.25 11.2,21.39 R3.1 11.92,21.17 13.68,19.41 16.21,19.41 17,20.2 17,21.73 16.81,21.92 14.89,21.92 | 8.51,25.09 8.99,25.09 10.47,26.58 11.4,26.58 12.1,27.28 12.1,28.21 12.83,28.93 12.92,28.93 12.96,28.96 24.1,28.96 24.96,28.11 24.96,27.28 25.66,26.58 27.34,26.58 CON1.17 29.54,25.23 30.74,26.42 31.72,26.42 32.42,25.72 32.42,24.89 33.28,24.04 36.79,24.04 37.35,23.47 37.35,21.9 C1.1 37.69,21.1 37.93,20.86 | U3.17 46.47,17.17 | 46.47,17.17 46.47,17.03 46.48,17.02 46.28,16.82 46.28,16.78 45.91,16.41 44.11,16.41 42.68,17.84 39.64,17.84 38.84,18.64 C15.2 38.62,20.17 37.93,20.86 | U1.1 52.44,22.83 52.48,22.86 53.26,22.07 SH1.DIG 53.47,16.46 52.78,16.46 52.56,16.23 47.41,16.23 46.47,17.17 | C16.+ 37.93,20.86 | LED1.A 6.44,18.53 v7.21,17.75 7.21,17.78 7.81,18.38 R1.2
  Top 0.508: v21.18,22.58 R4.1
  Bottom 0.152: v9.96,23.64 9.96,23.6 6.19,19.83 6.2,19.82 6.2,17.88 7.09,17.88 v7.21,17.75
  Bottom 0.508: v21.18,22.58 22.53,23.93 26.69,23.93 27.98,25.23 CON1.17
+5V  (via drill 0.35)
  Top 0.152: U8.7 12.39,18.32 11.48,18.32 11.22,18.58 11.22,19.63 10.87,19.98 10.8,19.98 | 6.48,19.98 5.84,19.98 C2.1 | C18.1 U7.4 v30.39,13.97 U7.13 31.17,9.56 31.17,9.96 31.3,10.1 31.99,10.1 32.44,9.65 32.44,7.57 32.57,7.44 33.26,7.44 33.71,7.89 33.71,9.96 33.84,10.1 34.53,10.1 34.67,9.96 34.67,9.72 35.62,8.77 C19.1 | R11.1 27.14,23.04 v26.09,23.04
  Top 0.254: 22.46,18.89 22.71,18.89 22.87,19.04 27.54,19.04 27.84,18.75 27.84,15.88 U7.6
  Top 0.305: C2.1 5.46,20.58 4.66,21.38 4.66,24.06 CON1.2 | U1.14 59.06,22.83 60.1,21.79 60.1,20.43 61.24,19.29 J1.3 | 22.46,21.01 22.53,21.09 U6.P$7 | 22.46,21.01 21.97,21.01 21.82,20.86 21.26,20.86 21.1,21.01 20.68,21.01 v20.68,20.93 18.16,18.41 R12.2 | 5.84,19.98 6.48,19.98 7.26,19.98 | 7.26,19.98 10.8,19.98 | 7.26,19.98 | 7.26,19.98 7.44,20.16 v7.44,20.19 | C17.1 22.46,18.89 22.46,21.01 | U7.6 v27.85,14.01 v27.84,14
  Top 0.508: v54.96,7.06 54.96,3.67 J6.3 | C20.+ 20.31,16.82 v19.94,16.82
  Top 0.813: CON1.4 CON1.2
  Bottom 0.152: v26.09,23.04 22.6,19.55 22.6,19.37
  Bottom 0.305: v7.44,20.19 8.52,20.19 8.96,19.74 14.71,19.74 16.05,21.08 20.57,21.08 20.65,21.01 20.65,20.96 v20.68,20.93 | v27.84,14 27.86,13.97 v30.39,13.97
  Bottom 0.508: J1.3 61.24,18.67 59.99,17.42 59.99,13.11 58.34,11.46 58.34,6.81 54.97,3.43 54.96,3.43 54.23,2.7 54.23,2.69 53.72,2.18 J6.3 | v20.68,20.93 21.04,20.93 22.6,19.37 23.14,18.82 | 23.14,18.82 25.1,16.87 40.81,16.87 43.41,14.27 44,14.27 52.76,5.52 53.41,5.52 v54.96,7.06 | v19.94,16.82 21.13,16.82 23.14,18.82
  pour Top (rank 2): 7.62,26.67 11.68,26.67 12.19,27.18 12.19,30.48 -1.27,30.48 -1.27,16.89 7.08,16.38 7.44,16.74 7.44,26.34 7.11,26.67 7.37,26.67 7.49,26.54
+5V-IN  (via drill 0.35)
  Top 0.305: Q1.D 12.31,6.39 12.31,4.06 13.63,2.74 14,2.74 v14.22,2.51
  Bottom 0.152: J5.1 31.57,2.51 30.17,3.92 30.17,6.16 29.33,7 21.86,7 21.74,6.88 21.74,3.89 20.88,3.02 19.33,3.02 18.82,2.51 v14.22,2.51
+5VCHARGE
  Top 0.152: R7.2 14.48,5.85 14.48,5.7 14.48,5.18 13.85,4.54 13.85,3.26 13.98,3.12 15.17,3.12 16.19,4.14 C13.1 17.34,4.88 20.85,4.88 22.45,6.48 22.45,6.99 | U4.4 18.08,8.98 18.59,9.48 20.75,9.48 22.45,7.77 22.45,6.99 | J4.VBUS 24.98,6.13 25.53,6.68 25.2,7 23.3,7 23.29,6.99 22.45,6.99
  Top 0.305: Q1.S 14.05,5.68 R7.2
/MUTE  (via drill 0.35)  (2 unrouted)
  Top 0.152: v34.01,22 33.3,22.71 29.19,22.71 v29.16,22.68 | v29.39,20.31 29.11,20.31 28.72,20.71 28.56,20.71 28.45,20.82 R11.2 | v28.93,17.65 28.93,16.61 29.11,16.43 U7.5 29.11,9.58 29.03,9.5 29.11,9.42 U7.12
  Bottom 0.152: CON1.36 50.34,26.56 50.34,23.73 49.27,22.66 35.86,22.66 35.3,23.22 35.3,23.34 34.95,23.7 34.44,23.7 34.09,23.34 34.09,22.1 34.01,22.03 v34.01,22 | v28.93,17.65 29.39,18.11 v29.39,20.31 29.16,20.54 v29.16,22.68
ACC-INT1  (via drill 0.35)
  Top 0.305: U2.6 13.24,21.96 12.65,22.55 12.65,22.61 v12.62,22.63
  Bottom 0.305: v12.62,22.63 14.05,24.05 15.48,24.05 15.5,24.04 19.02,24.04 19.04,24.05 20.14,24.05 21.07,24.98 CON1.11
ACC-INT2  (via drill 0.35)
  Top 0.305: U2.7 v12.62,21.46
  Bottom 0.305: CON1.13 22.76,25.23 21.11,23.58 14.74,23.58 v12.62,21.46
AGND  (via drill 0.35)
  Top 0.152: U8.8 10.35,18.9 R14.1 10.35,17.97 10.24,17.86 v10.24,17.78 | C22.2 15.85,9.64 15.85,8 | 15.85,8 15.85,7.91 15.33,7.39 11,7.39 10.93,7.32 | 10.93,7.32 10.61,7.32 8.5,9.42 7.96,9.42 J3.1 6.67,10.71 5.55,10.71 5.42,10.85 5.42,12.04 5.55,12.17 8.04,12.17 R15.1 8.39,14.44 v7.75,15.09 | C13.2 18.2,4.04 18.2,3.78 18.16,3.74 R8.2 16.77,2.03 17.58,1.23 18.89,1.23 19.08,1.41 19.08,2.09 v20.62,3.63 | 15.85,8 15.87,8.03 U4.2 20.17,8.03 20.68,7.52 v20.75,7.52 | v24.18,8.15 24.23,8.15 | 24.23,8.15 24.68,8.15 U7.9 25.3,8.69 25.3,7.37 25.65,7.01 26.87,7.01 | C20.- 16.46,14.73 | 16.46,14.73 16.76,15.03 16.76,15.04 17.83,13.97 19.47,13.97 21.71,11.73 22.65,11.73 22.79,11.59 22.79,9.01 23.65,8.15 24.23,8.15 | v18.87,12.68 18.53,13.01 18.12,13.01 17.76,12.64 14.7,12.64 14.33,13.01 U8.4 | J4.GND 27.59,7.01 26.87,7.01 | C19.2 36.37,7.29 | C21.2 C17.2 22.74,17.48 19.21,17.48 16.46,14.73 | v52.35,15.32 41.37,15.32 40.24,14.19 | 40.24,14.19 C5.2 39.64,13.5 | U7.11 27.84,7.98 26.87,7.01 | v40.41,12.32 40.41,12.72 39.64,13.5 | 40.24,14.19 40.24,14.11 39.64,13.5 | 10.93,7.32 10.93,4.83 Q1.G
  Top 0.254: J5.2 36.06,3.45 37.85,1.67 46.33,1.67 46.93,2.27 46.93,4.64 44.81,6.76 C12.1
  Top 0.305: C8.2 45.82,10.43 U3.3 45.65,12.04 45.65,12.75 44.89,13.51 43.28,13.51 v43.26,13.49 | U3.9 49.72,10.83 49.78,10.77 50.7,10.77 v50.95,10.52 | v54.76,11.02 55.46,11.72 C4.- 55.9,12.5 v55.9,14.3 | SH2.AN 35.23,19.26 v35.36,19.14 | v35.36,17.78 v37.54,15.6 39.64,13.5 | v37.31,12.24 36.37,11.3 36.37,11.05 36.91,10.51 36.91,8.58 36.37,8.04 36.37,7.29
  Top 0.508: C12.1 43.8,8.48 43.34,8.48 42.92,8.9 C14.- 40.05,10.72 39.87,10.72 | v40.41,12.32 40,11.91 40,10.99 39.81,10.8 39.87,10.72 | C7.2 39.87,10.72
  Top 0.813: C4.- 56.11,9.96 56.39,9.67 56.39,9.53 C3.1
  Bottom 0.152: v24.18,8.15 21.39,8.15 v20.75,7.52 20.75,3.76 v20.62,3.63 | v10.24,17.78 7.77,15.32 7.77,15.11 v7.75,15.09 | v24.18,8.15 23.39,8.15 22.32,9.23 22.32,9.62 21.97,9.98 21.57,9.98 v18.87,12.68 | 25.32,8.15 30.35,8.15 30.35,7.18 30.31,7.14 30.31,6.63 30.66,6.28 32.23,6.28 J5.2 | 25.32,8.15 v24.18,8.15 | v31.52,12.47 29.77,12.47 v29.74,12.45 v27.86,12.45 26.62,11.2 23.57,11.2 23.22,10.84 23.22,10.34 23.57,9.99 25.24,9.99 25.32,9.91 25.32,8.15 | v42.29,17.02 41.53,17.78 v35.36,17.78
  Bottom 0.305: v50.95,10.52 51.46,11.02 v54.76,11.02 | v43.26,13.49 43.24,13.47 42.09,12.32 v40.41,12.32 | v35.36,19.14 v35.36,17.78 | v55.9,14.3 53.36,14.3 v52.35,15.32 | v37.31,12.24 37.31,15.37 v37.54,15.6
  pour Top: 57.45,8.46 57.84,8.46 57.96,8.46
  pour Top (rank 2): 48.26,19.05 49.53,19.05 52.07,16.51
  pour Top (rank 2): 36.07,23.37 36.19,23.24 36.32,23.11 39.37,19.18 39.37,18.8
  pour Top: 0.23,19.79 0.23,1.02 1.32,-0.08 57.33,-0.08 58.14,0.74 58.14,5.71 72.16,19.74 0.56,19.74 0.48,19.81 0.25,19.81
AN3V3
  Top 0.305: U3.1 44.52,9.2 44.5,9.18 | U3.8 49.07,13.11 | 49.07,13.11 52.4,13.11 53.05,12.46 C4.+ | 49.07,13.11 49.07,14.71 48.95,14.83 42.19,14.83 41.83,14.48 C14.+
  Top 0.508: C14.+ 43.96,9.18 44.5,9.18 C12.2 | SH1.AN 53.26,12.68 53.05,12.46 | C4.+ 53.11,11.12 C3.2
ANGND
  pour Bottom: 0.84,19.86 3.36,19.86 3.54,19.68 43.26,19.68 44.53,18.41 45.54,17.4 55.75,17.4 58.04,15.11 58.04,5.82 58.24,5.61 64.57,5.61 64.57,0.28 0.84,-0.44
AUDIO-LEFT  (via drill 0.35)  (2 unrouted)
  Top 0.152: v39.65,7.62 39.65,9.01 C7.1 | 26.58,11.88 28.32,10.14 28.32,7.59 28.9,7 30.8,7 v30.91,6.89
  Top 0.305: v50.95,6.2 50.85,6.3 R6.2
  Bottom 0.152: v50.95,6.2 49.53,7.62 v39.65,7.62 38.99,6.96 30.99,6.96 v30.91,6.89
AUDIO-RIGHT  (via drill 0.35)  (1 unrouted)
  Top 0.152: v43.31,16.1 40.46,16.1 C5.1 39.6,15.29 36.36,18.53 33.31,18.53 32.95,18.89 29.31,18.89 28.32,17.9 28.32,17.4 28.63,17.1 28.63,13.61 28.4,13.39 27.2,13.39 27.06,13.53 27.06,17.06 26.92,17.2 26.23,17.2 26.1,17.06 26.1,11.92 26.57,11.46
  Top 0.305: R5.2 53.09,7.48 v53.09,6.3
  Bottom 0.152: v53.09,6.3 49.76,9.63 49.76,14.91 48.56,16.1 v43.31,16.1
EN
  Top 0.152: JP1.1 3.58,22.73 4.27,22.04 4.27,20.17 4.87,19.58 8.5,19.58 9.51,18.57 9.51,15.47 9.64,15.34 10.98,15.34 12.39,13.93 12.39,13.67 | 12.39,13.67 U8.2 | R13.1 19.29,13.67 18.35,13.67 17.63,12.95 14.83,12.95 13.98,13.79 12.74,13.79 12.62,13.67 12.39,13.67
GND  (via drill 0.35)  (3 unrouted)
  Top 0.152: U3.12 49.71,19.05 49.86,19.2 50.13,18.93 50.48,18.93 | v29.83,21.73 29.19,21.09 28.72,21.09 28.44,21.37 28.44,21.41 28.3,21.55 27.02,21.55 26.56,21.09 U6.P$2 25.84,21.23 24.87,21.23 24.51,21.59 U6.P$6 | U7.2 32.93,17.31 C18.2 32.92,17.32 32.79,17.2 31.31,17.2 31.18,17.06 31.18,13.93 32.92,12.19 U7.15
  Top 0.305: U2.13 15.06,20.06 U2.11 | U2.15 16.29,21.41 15.87,21.41 15.69,21.23 15.69,20.7 15.95,20.44 U2.13 | 9.4,21.23 6.29,21.23 C2.2 6.1,22.69 v6.1,23.52 | 9.4,21.23 9.4,22.12 C6.2 | U2.9 U2.10 U2.8 14.47,20.96 14.48,20.96 14.53,20.96 v14.55,20.98 | U2.12 U2.13 | v9.37,20.73 9.37,21.21 9.4,21.23 | 34.84,21.09 C1.2 | 28.72,21.09 34.84,21.09 | U1.7 50.48,18.93 50.34,18.8 50.36,18.78 U3.11 50.39,18.03 v51.26,18.03 | 41.85,22.23 41.85,22.35 C16.- 44.04,22.28 C11.+ 44.31,20.86 45.17,19.99 U3.19 | C15.1 C10.2 41.85,18.72 41.85,20.55 | U3.10 50.51,11.74 51.16,11.74 51.41,11.99 v51.41,12.09 | 38.95,25.13 CON1.25 40.09,26.47 42.87,26.47 43.93,27.52 CON1.30 45.23,26.47 47.85,26.47 49.01,27.62 CON1.34 50.31,26.47 55.39,26.47 CON1.39 | 38.95,25.13 41.85,22.23 | CON1.20 32.08,27.77 33.28,26.58 34.94,26.58 35.1,26.42 35.81,26.42 35.82,26.42 36.8,26.42 38.1,25.13 38.95,25.13 | R2.1 3.47,17.65 JP1.3 | 41.85,22.23 41.85,20.55 | 41.85,20.55 41.9,20.6 43.13,20.6 v43.18,20.55 | U3.16 47.12,20.51 v47.09,20.55 | v34.09,19.14 SH2.DIG 34.09,20.33 34.84,21.09 | v34.06,17.8 32.43,17.8 C18.2
  Top 0.508: U2.10 15.06,20.06
  Bottom 0.305: 31.23,23.22 31.23,23.54 30.04,24.74 30.04,25.72 31.23,26.92 31.23,27.69 | 31.23,27.69 CON1.20 | CON1.39 56.92,25.23 J1.4 62.99,19.15 62.99,11.38 62.46,10.85 J2.2 J2.4 56.08,2.18 J6.4 | 31.23,27.69 30.29,27.69 29.18,26.58 24.8,26.58 CON1.14 22.26,26.42 20.58,26.42 19.38,25.23 CON1.9 17.18,26.58 15.5,26.58 14.3,27.77 CON1.6 12.24,28.98 7.89,28.98 6.1,27.18 v6.1,23.52 6.32,23.75 6.32,25.39 7.35,26.42 9.38,26.42 9.56,26.25 9.56,24.21 7.62,22.28 6.48,22.28 JP1.3 | v14.55,20.98 14.3,20.73 v9.37,20.73 | v51.41,12.09 51.41,17.83 51.26,17.98 v51.26,18.03 49.68,19.61 49.68,20.22 49.28,20.62 48.71,20.62 48.64,20.55 v47.09,20.55 | v43.18,20.55 v47.09,20.55 | v47.09,20.55 | v34.09,19.14 34.09,17.83 v34.06,17.8
  Bottom 0.813: 31.23,23.22 31.23,23.13 30.78,22.68 v29.83,21.73
  pour Bottom (rank 2): -1.75,30.48 -1.75,20.29 46.99,20.32 48.26,19.05 49.53,17.78 55.88,17.78 57.15,16.51 58.42,15.24 58.42,6.43 65.68,6.43 65.68,30.48
  pour Top (rank 3): 57.58,15.67 57.58,0.56 64.72,0.56 64.72,23.24 58.42,23.24 58.42,16.51
  pour Top (rank 2): 46.74,19.43 46.99,19.68 46.99,22.48 46.99,22.86 46.23,23.62
GPI022-OUT
  Top 0.305: U1.11 58.72,20.88 58.72,19.87 59.18,19.41 59.18,17.98 59.64,17.53 59.64,16.24 59.66,16.22 J2.1
GPIO21
  Top 0.152: CON1.29 44.89,25.23 46.01,24.11 46.96,24.11 50.88,20.19 51.5,20.19 U1.5
GPIO21-OUT
  Top 0.305: U1.10 58.21,20.23 58.27,20.17 58.27,10.63 59.66,9.23 J2.3
GPIO22
  Top 0.152: U1.4 51.27,21.15 50.81,21.15 49.76,22.2 49.76,24 49.65,24.11 48.55,24.11 47.43,25.23 CON1.31
GPIO23
  Top 0.152: U1.3 50.86,21.53 50.09,22.3 50.09,24.77 49.62,25.23 CON1.33
GPIO23-OUT
  Top 0.305: U1.12 58.99,21.53 59.18,21.34 59.18,20.05 59.64,19.6 59.64,18.19 60.15,17.68 60.15,17.43 60.1,17.38 60.1,16.43 61.24,15.29 J1.1
GPIO25
  Top 0.305: U1.2 50.77,22.18 50.74,22.21 50.74,23.11 50.92,23.29 51.84,23.29 53.78,25.23 CON1.37
GPIO25-OUT
  Top 0.305: J1.2 61.24,17.29 60.1,18.43 60.1,19.79 59.64,20.24 59.64,21.59 59.03,22.2 59.01,22.18 U1.13
L+
  Top 0.305: J7.4 42.41,6.94 39.37,6.94 38.71,7.59 38.71,12.72 35.57,15.87 U7.1
L-
  Top 0.305: J7.3 40.33,6.48 39.18,6.48 38.05,7.61 38.05,12.62 36.65,14.02 33,14.02 31.66,15.36 U7.3
N$1
  Top 0.152: U3.7 48.42,10.76 48.45,10.74 49.08,10.74 49.12,10.7 49.48,10.46 50.34,9.91 51.49,9.91 52.17,9.23 R5.1
N$2
  Top 0.152: U3.5 47.12,10.93 47.63,10.42 47.63,10.32 C8.1
N$3
  Top 0.152: U3.4 46.47,11.15 47.32,10.3 47.32,9.06 48.25,8.14 C9.1
N$4
  Top 0.305: C9.2 45.61,8.61 45.61,9.86 45.16,10.31 45.16,11.86 U3.2
N$5  (1 unrouted)
N$6
  Top 0.305: LED1.C 5.82,16.6 R2.2
N$7
  Top 0.152: U7.8 25.31,16.87 C21.1
N$8  (1 unrouted)
N$10  (1 unrouted)
N$11
  Top 0.152: U3.6 47.77,10.8 48.14,10.43 48.95,10.43 49.02,10.36 R6.1
N$12
  Top 0.305: C11.- 45.82,21.86 U3.18 45.82,16.97 45.72,16.87 44.3,16.87 44.04,17.12 44.04,18.07 C10.1
N$13  (1 unrouted)
N$15  (via drill 0.35)
  Top 0.152: U4.5 16.49,6.88 15.39,6.88 v15.29,6.79 | v19.54,4.09 19.54,3.27 R8.1
  Bottom 0.152: v15.29,6.79 17.88,4.19 19.53,4.19 v19.53,4.1 v19.54,4.09
N$16
  Top 0.152: U4.1 18.25,6.04 D1.C
N$17
  Top 0.152: R12.1 14.59,18.41 13.85,17.67 | 13.85,17.67 U8.5 | 13.85,17.67 13.5,17.67 13.47,17.71 13.47,18.16 13.33,18.29 12.89,18.29 R14.2
N$18
  Top 0.305: U8.1 11.74,11.97 11.73,11.96 11.73,10.17 L1.2
N$19
  Top 0.152: U8.6 13.04,15.55 12.85,15.37 11.38,15.37 11.1,15.64 10.81,15.64 R15.2
N$23
  Top 0.152: D1.A 16.45,5.77 R7.1
OE
  Top 0.152: CON1.38 55.01,26.85 55.55,26.85 56.05,26.35 57.09,26.35 57.75,25.69 57.75,24.77 55.8,22.82 55.8,19.3 56.18,18.93 U1.8
PCM-CLK  (via drill 0.35)
  Top 0.305: CON1.12 21.92,27.77 23.12,26.58 24.21,26.58 24.96,25.83 24.96,24.74 25.66,24.04 28.08,24.04 28.35,23.77 32,23.77 32.69,23.09 v34.7,23.09 | U3.13 49.06,19.75 49,19.81 v49,19.94
  Bottom 0.305: v34.7,23.09 34.7,21.82 36.65,19.86 48.92,19.86 v49,19.94
PCM_DOUT  (via drill 0.35)
  Top 0.305: U3.14 48.58,17.83 48.58,17.12 48.78,16.92 v52.27,16.92
  Bottom 0.305: v52.27,16.92 53.29,17.93 53.29,23.72 53.6,24.04 54.58,24.04 55.28,24.74 55.28,25.72 56.63,27.06 CON1.40
PCM_FS  (via drill 0.35)
  Top 0.305: U3.15 47.77,20.49 v48.69,21.41
  Bottom 0.305: v48.69,21.41 51.55,24.27 CON1.35
PWR-LED
  Top 0.152: JP1.2 3.02,19.03 3.47,19.03 4.76,19.03 4.89,18.89 4.89,17.77 5.41,17.25 6.69,17.25 7.27,16.68 R1.1
R+
  Top 0.305: U7.16 34.19,6.04 34.51,5.72 38.26,5.72 40.53,3.45 J7.2
R-
  Top 0.305: U7.14 31.65,6.27 32.65,5.27 35.49,5.27 37.3,3.45 J7.1
SCL
  Top 0.152: U6.P$4 24.88,22.09 23.77,23.19 20.44,23.19 19.77,22.52 R4.2
  Top 0.305: CON1.5 14.35,24.33 14.55,24.33 15.3,23.58 | 15.3,23.58 15.45,23.43 U2.2 | 15.3,23.58 15.36,23.52 16.21,23.52 17.21,22.52 R4.2
SCL-OUT  (via drill 0.35)
  Top 0.152: v31.44,20.4 31.25,20.21 30.96,20.21 30.46,19.71 26.71,19.71 26.26,20.15 26.26,20.31 U6.P$1
  Bottom 0.152: v31.44,20.4 31.44,22.45 32.35,23.35 32.35,27.98 33.26,28.89 57.09,28.89 57.75,28.23 57.75,26.15 64,19.9 64,19.46 63.96,8.31 61.62,5.97 60.48,5.97 59.03,4.52 59.03,4.23 55.92,1.12 51.03,1.12 49.97,2.18 J6.1
SDA  (via drill 0.35)
  Top 0.152: U6.P$5 22.09,22.09 v21.54,21.54
  Top 0.305: U2.3 14.89,22.92 14.89,23.34 14.36,23.88 11.43,23.88 11.06,24.24 10.91,24.4 10.91,24.43 | 10.91,24.43 CON1.3 | R3.2 11.2,24.14 10.91,24.43
  Bottom 0.152: v21.54,21.54 15.97,21.54 14.55,20.12 9.12,20.12 8.77,20.48 8.77,20.98 10.91,23.12 CON1.3
SDA-OUT  (via drill 0.35)
  Top 0.152: v32.56,20.4 32.3,20.4 31.3,19.4 26.14,19.4 24.92,20.62 23.12,20.62 U6.P$8
  Bottom 0.152: v32.56,20.4 35.57,20.4 36.67,19.31 49.22,19.31 50.65,17.88 50.65,11.99 51.16,11.48 51.66,11.48 53.23,13.06 55.88,13.06 55.88,6.59 J6.2
VBATT  (via drill 0.35)
  Top 0.152: 13.21,8.6 13.13,8.52 13.13,7.91 12.92,7.7 10.77,7.7 | U4.3 19.47,8.79 v20.52,8.79 | v21.71,9.37 20.31,10.78 R13.2
  Top 0.305: R13.2 19.02,10.95 C22.1 18.51,10.67 17.41,11.78 16.35,11.78 16.17,11.6 16.17,11.57 L1.1 | U8.3 13.04,12.31 14.62,10.73 L1.1 | J3.2 9.14,10.25 10.37,10.25 10.59,10.03 10.59,7.88 10.77,7.7 | L1.1 13.21,8.6
  Bottom 0.152: v20.52,8.79 21.16,9.42 21.67,9.42 v21.71,9.38 v21.71,9.37

### Text on the board
tNames: EN | GND | IND | VCC | 25 | 23 | 22 | GND | L+ | 21 | GND | R- | R+ | L- | HappyBrackets / HiFi LiPo - Rev. 1 | SCL | SDA | VCC | GND | + | UNSW